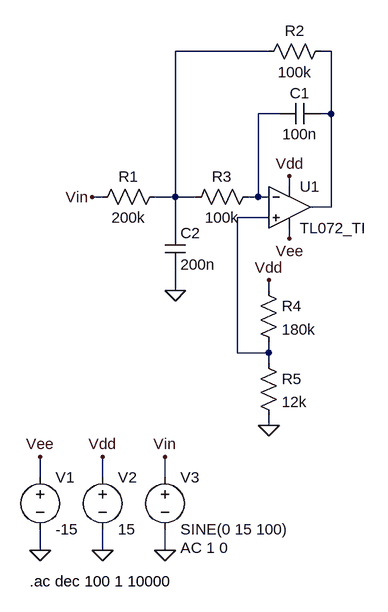
[diagram p0: schematic Filtro_PB.asc]
Filtro_PB.asc, the LTspice schematic file:
Version 4
SHEET 1 880 856
WIRE 160 -48 16 -48
WIRE 256 -48 240 -48
WIRE 176 48 144 48
WIRE 256 48 256 -48
WIRE 256 48 240 48
WIRE 192 160 192 144
WIRE -96 176 -112 176
WIRE 16 176 16 -48
WIRE 16 176 -16 176
WIRE 48 176 16 176
WIRE 144 176 144 48
WIRE 144 176 128 176
WIRE 160 176 144 176
WIRE 256 192 256 48
WIRE 256 192 224 192
WIRE 160 208 112 208
WIRE 16 224 16 176
WIRE 192 240 192 224
WIRE 16 320 16 288
WIRE 160 320 160 304
WIRE 112 416 112 208
WIRE 160 416 160 400
WIRE 160 416 112 416
WIRE 160 432 160 416
WIRE 160 528 160 512
WIRE -192 608 -192 576
WIRE -96 608 -96 576
WIRE 0 608 0 576
WIRE -192 720 -192 688
WIRE -96 720 -96 688
WIRE 0 720 0 688
FLAG 16 320 0
FLAG 192 144 Vdd
FLAG 192 240 Vee
FLAG -96 720 0
FLAG -192 720 0
FLAG -96 576 Vdd
FLAG -192 576 Vee
FLAG 0 720 0
FLAG 0 576 Vin
FLAG -112 176 Vin
FLAG 160 304 Vdd
FLAG 160 528 0
SYMBOL EXTRA\\AudioOpamp\\TI\\TL072_TI 192 192 R0
SYMATTR InstName U1
SYMBOL cap 240 32 R90
WINDOW 0 0 32 VBottom 2
WINDOW 3 32 32 VTop 2
SYMATTR InstName C1
SYMATTR Value 100n
SYMBOL res 0 160 R90
WINDOW 0 0 56 VBottom 2
WINDOW 3 32 56 VTop 2
SYMATTR InstName R1
SYMATTR Value 200k
SYMBOL res 144 160 R90
WINDOW 0 0 56 VBottom 2
WINDOW 3 32 56 VTop 2
SYMATTR InstName R3
SYMATTR Value 100k
SYMBOL res 256 -64 R90
WINDOW 0 0 56 VBottom 2
WINDOW 3 32 56 VTop 2
SYMATTR InstName R2
SYMATTR Value 100k
SYMBOL cap 0 224 R0
SYMATTR InstName C2
SYMATTR Value 200n
SYMBOL voltage -192 592 R0
SYMATTR InstName V1
SYMATTR Value -15
SYMBOL voltage -96 592 R0
SYMATTR InstName V2
SYMATTR Value 15
SYMBOL voltage 0 592 R0
WINDOW 123 24 124 Left 2
WINDOW 39 0 0 Left 0
SYMATTR Value2 AC 1 0
SYMATTR InstName V3
SYMATTR Value SINE(0 15 100)
SYMBOL res 144 304 R0
SYMATTR InstName R4
SYMATTR Value 180k
SYMBOL res 144 416 R0
SYMATTR InstName R5
SYMATTR Value 12k
TEXT -208 768 Left 2 !.ac dec 100 1 10000

The netlist it stands for:
* Filtro_PB.asc
* U1: TL072_TI (symbol EXTRA\AudioOpamp\TI\TL072_TI not available, pins judged from their places): In+=N004 In-=N003 V+=Vdd V-=Vee OUT=N002
C1 N002 N003 100n
R1 N001 Vin 200k
R3 N003 N001 100k
R2 N002 N001 100k
C2 N001 0 200n
V1 Vee 0 -15
V2 Vdd 0 15
V3 Vin 0 SINE(0 15 100) AC 1 0
R4 Vdd N004 180k
R5 N004 0 12k
.ac dec 100 1 10000
.backanno
.end